# EAGLE design spot_check_rev_2 (EAGLE 9.6.2)
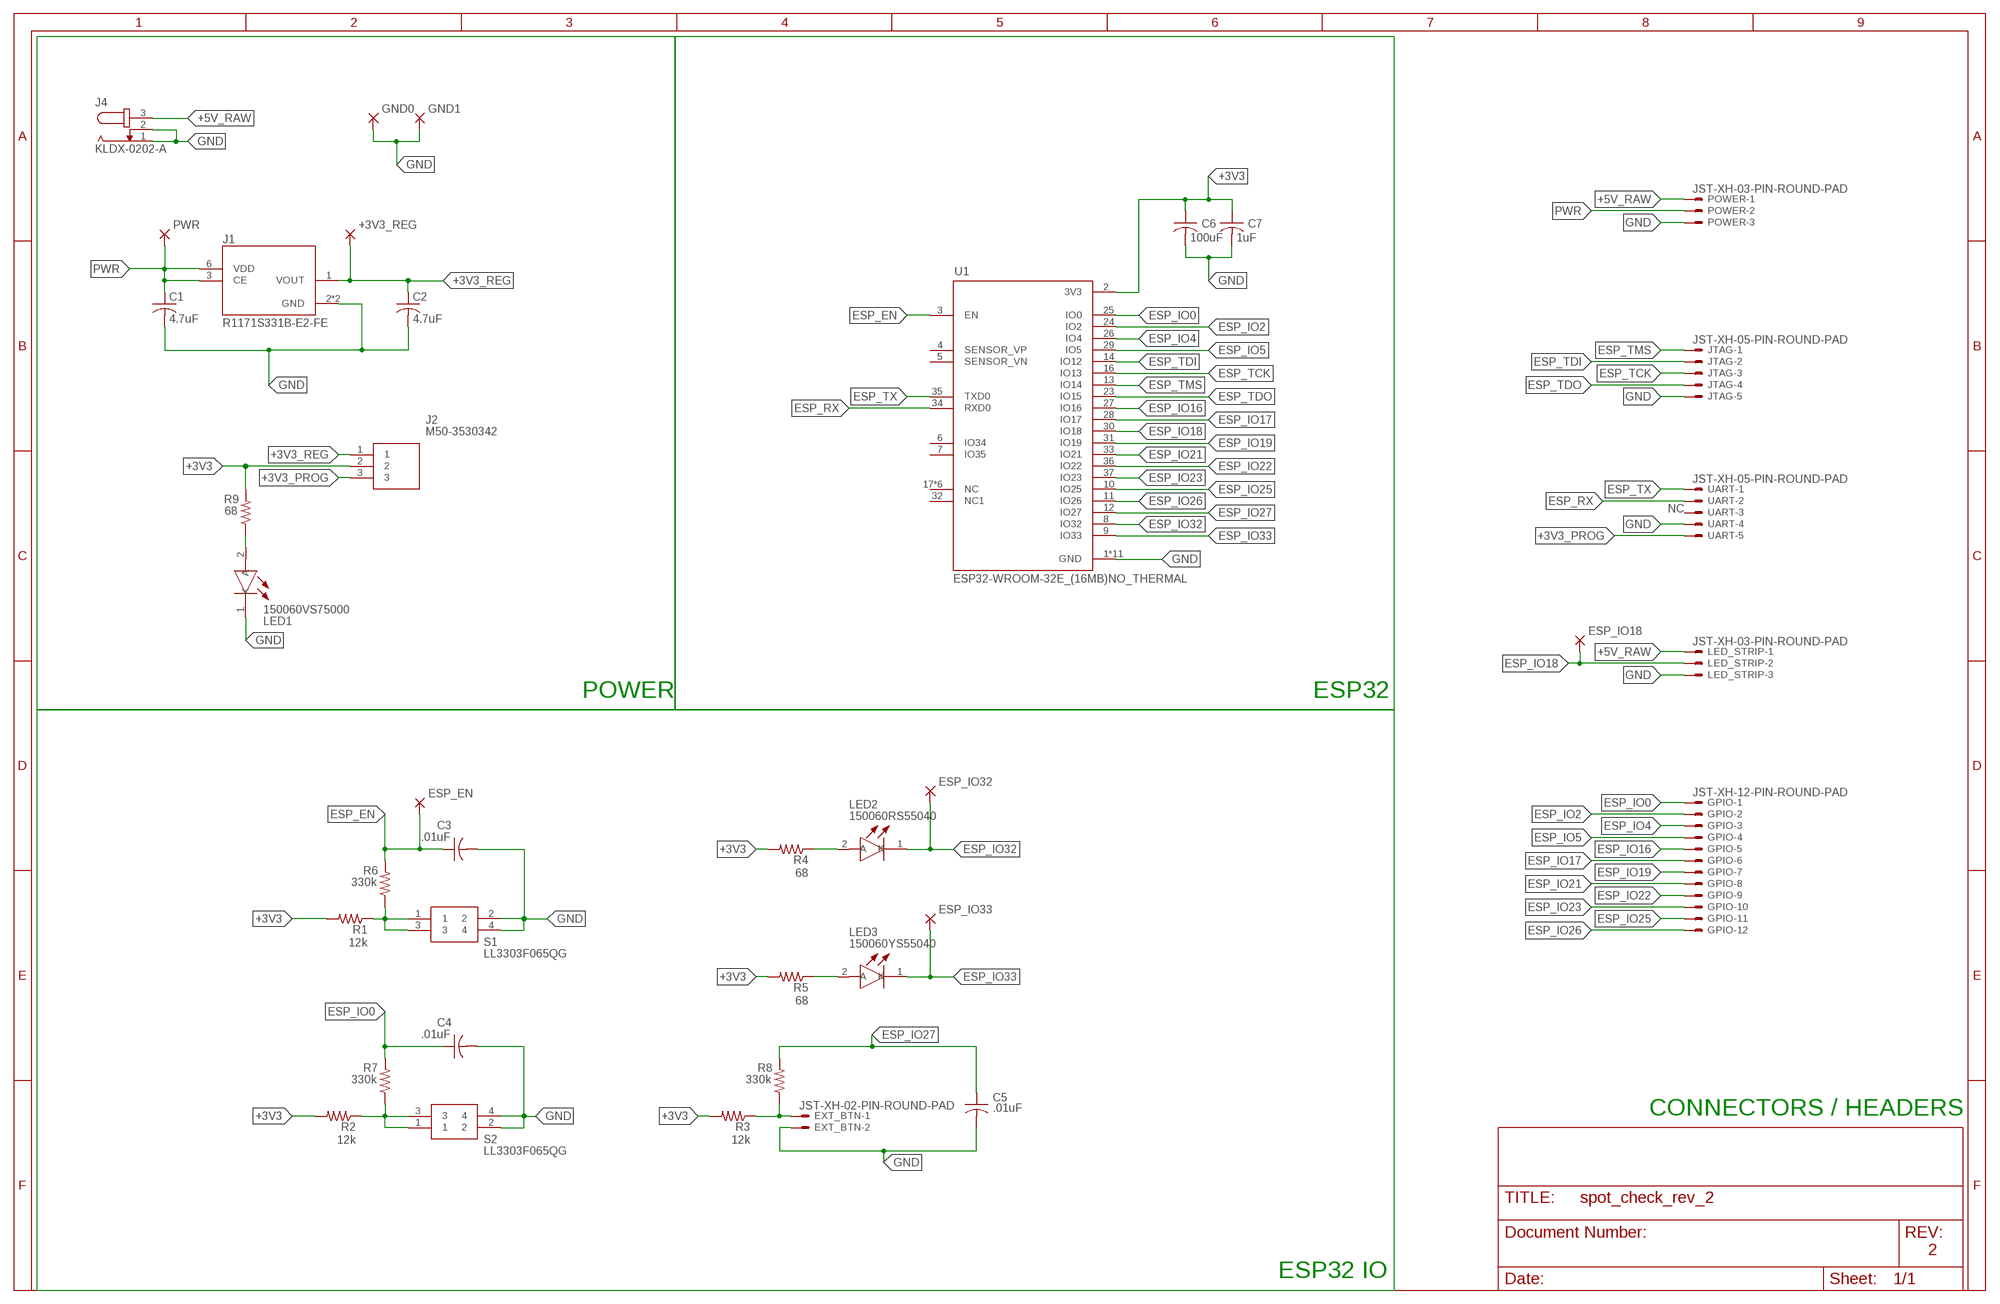
[diagram p0: schematic, sheet 1]

## Parts
+3V3_REG  TP  2,54/1,1  [2,54/1,1]
C1  4.7uF  C-USC0805  [C0805]
C2  4.7uF  C-USC0805  [C0805]
C3  .01uF  C-USC0805  [C0805]
C4  .01uF  C-USC0805  [C0805]
C5  .01uF  C-USC0805  [C0805]
C6  100uF  C-USC0805  [C0805]
C7  1uF  C-USC0805  [C0805]
ESP_EN  TP  2,54/1,1  [2,54/1,1]
ESP_IO18  TP  2,54/1,1  [2,54/1,1]
ESP_IO32  TP  2,54/1,1  [2,54/1,1]
ESP_IO33  TP  2,54/1,1  [2,54/1,1]
EXT_BTN  JST-XH-02-PIN-ROUND-PAD  [JST-XH-02-PACKAGE-ROUND-PAD]
GND0  TP  2,54/1,1  [2,54/1,1]
GND1  TP  2,54/1,1  [2,54/1,1]
GPIO  JST-XH-12-PIN-ROUND-PAD  [JST-XH-12-PACKAGE-ROUND-PAD]
J1  R1171S331B-E2-FE  R1171S421B-E2-FE  [REG_R1171S421B-E2-FE]
J2  M50-3530342  [HDRV3W40P0X127_1X3_381X210X430]
J4  KLDX-0202-A  CONN-JACK  [SPC4077]
JTAG  JST-XH-05-PIN-ROUND-PAD  [JST-XH-05-PACKAGE-ROUND-PAD]
LED1  150060VS75000  [LEDC1608X80N]
LED2  150060RS55040  150060VS75000  [LEDC1608X80N]
LED3  150060YS55040  150060VS75000  [LEDC1608X80N]
LED_STRIP  JST-XH-03-PIN-ROUND-PAD  [JST-XH-03-PACKAGE-ROUND-PAD]
POWER  JST-XH-03-PIN-ROUND-PAD  [JST-XH-03-PACKAGE-ROUND-PAD]
PWR  TP  2,54/1,1  [2,54/1,1]
R1  12k  R-US_R0805  [R0805]
R2  12k  R-US_R0805  [R0805]
R3  12k  R-US_R0805  [R0805]
R4  68  R-US_R0805  [R0805]
R5  68  R-US_R0805  [R0805]
R6  330k  R-US_R0805  [R0805]
R7  330k  R-US_R0805  [R0805]
R8  330k  R-US_R0805  [R0805]
R9  68  R-US_R0805  [R0805]
S1  LL3303F065QG  [LL3303F065QG]
S2  LL3303F065QG  [LL3303F065QG]
U1  ESP32-WROOM-32E_(16MB)NO_THERMAL  [MODULE_ESP32-WROOM-32E_(16MB)]
UART  JST-XH-05-PIN-ROUND-PAD  [JST-XH-05-PACKAGE-ROUND-PAD]

## Nets
+3V3: C6.1 C7.1 J2.2 R1.2 R2.2 R3.2 R4.2 R5.2 R9.2 U1.2(3V3)
+3V3_PROG: J2.3 UART.5
+3V3_REG: +3V3_REG.1(P) C2.1 J1.1(VOUT) J2.1
+5V_RAW: J4.3 LED_STRIP.1 POWER.1
ESP_EN: C3.1 ESP_EN.1(P) R6.2 U1.3(EN)
ESP_IO0: C4.1 GPIO.1 R7.2 U1.25(IO0)
ESP_IO2: GPIO.2 U1.24(IO2)
ESP_IO4: GPIO.3 U1.26(IO4)
ESP_IO5: GPIO.4 U1.29(IO5)
ESP_IO16: GPIO.5 U1.27(IO16)
ESP_IO17: GPIO.6 U1.28(IO17)
ESP_IO18: ESP_IO18.1(P) LED_STRIP.2 U1.30(IO18)
ESP_IO19: GPIO.7 U1.31(IO19)
ESP_IO21: GPIO.8 U1.33(IO21)
ESP_IO22: GPIO.9 U1.36(IO22)
ESP_IO23: GPIO.10 U1.37(IO23)
ESP_IO25: GPIO.11 U1.10(IO25)
ESP_IO26: GPIO.12 U1.11(IO26)
ESP_IO27: C5.1 R8.2 U1.12(IO27)
ESP_IO32: ESP_IO32.1(P) LED2.1(K) U1.8(IO32)
ESP_IO33: ESP_IO33.1(P) LED3.1(K) U1.9(IO33)
ESP_RX: U1.34(RXD0) UART.2
ESP_TCK: JTAG.3 U1.16(IO13)
ESP_TDI: JTAG.2 U1.14(IO12)
ESP_TDO: JTAG.4 U1.23(IO15)
ESP_TMS: JTAG.1 U1.13(IO14)
ESP_TX: U1.35(TXD0) UART.1
GND: C1.2 C2.2 C3.2 C4.2 C5.2 C6.2 C7.2 EXT_BTN.2 GND0.1(P) GND1.1(P) J1.2(GND) J1.5(GND) J4.1 J4.2 JTAG.5 LED1.1(K) LED_STRIP.3 POWER.3 S1.2 S1.4 S2.2 S2.4 U1.1(GND) U1.15(GND) U1.38(GND) U1.39_1(GND) U1.39_3(GND) U1.39_4(GND) U1.39_6(GND) U1.39_7(GND) U1.39_9(GND) U1.39_13(GND) U1.39_18(GND) UART.4
N$1: EXT_BTN.1 R3.1 R8.1
N$2: LED2.2(A) R4.1
N$3: LED3.2(A) R5.1
N$4: LED1.2(A) R9.1
N$5: R1.1 R6.1 S1.1 S1.3
N$6: R2.1 R7.1 S2.1 S2.3
PWR: C1.1 J1.3(CE) J1.6(VDD) POWER.2 PWR.1(P)
Unconnected: U1.4(SENSOR_VP) U1.5(SENSOR_VN) U1.6(IO34) U1.7(IO35) U1.17(NC) U1.18(NC) U1.19(NC) U1.20(NC) U1.21(NC) U1.22(NC) U1.32(NC1) UART.3

## Notes on the sheet
- POWER | ESP32
- CONNECTORS / HEADERS
- 2
- ESP32 IO

## Library data of the parts
+3V3_REG ESP_EN ESP_IO18 ESP_IO32 ESP_IO33 GND0 GND1 PWR = wirepad:2,54/1,1: THROUGH-HOLE PAD
C1-C7 = rcl:C-US: CAPACITOR, American symbol; SPICEPREFIX: C
EXT_BTN = Rembrandt Electronics - JST XH Connectors v1-0:JST-XH-02-PIN: JST XH Connector 2 Pin Wire to board connector. Pitch: 2,54 mm, (0.100") Number of pins: 2 Created by Rembrandt Electronics www.rembrandtelectronics.com
GPIO = Rembrandt Electronics - JST XH Connectors v1-0:JST-XH-12-PIN: JST XH Connector 2 Pin Wire to board connector. Pitch: 2,54 mm, (0.100") Number of pins: 12 Created by Rembrandt Electronics www.rembrandtelectronics.com
J1 = R1171S421B-E2-FE:R1171S421B-E2-FE: R1171x SERIES, 2.0A/1.5A LDO REUGULATOR Check prices <https://pricing.snapeda.com/parts/R1171S421B-E2-FE/Ricoh/view-part?ref=eda>; AVAILABILITY: In Stock; DESCRIPTION: Linear Voltage Regulator IC Positive Fixed 1 Output 1.5A 6-HSOP-J; MF: Ricoh; MP: R1171S421B-E2-FE; PACKAGE: SOIC-6 Ricoh; PRICE: None
J2 = M50-3530342:M50-3530342: Headers & Wire Housings 3 WAY SIL VERT PC TAIL P/HDR Source: Datasheet <https://cdn.harwin.com/pdfs/M50-353.pdf>; DESCRIPTION: Headers & Wire Housings 3 WAY SIL VERT PC TAIL P/HDR; HEIGHT: 4.3mm; MANUFACTURER_NAME: Harwin; MANUFACTURER_PART_NUMBER: M50-3530342; MOUSER_PART_NUMBER: 855-M50-3530342; MOUSER_PRICE-STOCK: https://www.mouser.co.uk/ProductDetail/Harwin/M50-3530342?qs=%252BdQmOuGyFcFOxjGK%2F4HnAg%3D%3D
J4 = custom-conn-jack:CONN-JACK
JTAG = Rembrandt Electronics - JST XH Connectors v1-0:JST-XH-05-PIN: JST XH Connector 2 Pin Wire to board connector. Pitch: 2,54 mm, (0.100") Number of pins: 5 Created by Rembrandt Electronics www.rembrandtelectronics.com
LED1-LED3 = 150060VS75000:150060VS75000: LED,Wurth Elektronik,150060VS75000 Wurth Elektronik 150060VS75000, WL-SMCW Series Green LED, 570 nm, 1608 (0603) Clear, Rectangle Lens SMD Package Source: Datasheet <http://docs-emea.rs-online.com/webdocs/1302/0900766b81302e1e.pdf> Check prices <https://pricing.snapeda.com/parts/150060VS75000/Wurth%20Elektronik/view-part?ref=eda>; AVAILABILITY: In Stock; DESCRIPTION: Green 570nm LED Indication - Discrete 2V 0603 (1608 Metric); MF: Wurth Elektronik; MP: 150060VS75000; PACKAGE: None; PRICE: None
LED_STRIP POWER = Rembrandt Electronics - JST XH Connectors v1-0:JST-XH-03-PIN: JST XH Connector 2 Pin Wire to board connector. Pitch: 2,54 mm, (0.100") Number of pins: 3 Created by Rembrandt Electronics www.rembrandtelectronics.com
R1-R9 = rcl:R-US_: RESISTOR, American symbol; SPICEPREFIX: R
S1 S2 = LL3303F065QG:LL3303F065QG: Pushbutton Switches 50mA 12VDC F065 7.0mm Gull Wing Source: Datasheet <http://spec_sheets.e-switch.com/specs/P090008.pdf>; DESCRIPTION: Pushbutton Switches 50mA 12VDC F065 7.0mm Gull Wing; HEIGHT: 3.4mm; MANUFACTURER_NAME: E-Switch; MANUFACTURER_PART_NUMBER: LL3303F065QG; MOUSER_PART_NUMBER: 612-LL3303F065QG; MOUSER_PRICE-STOCK: https://www.mouser.co.uk/ProductDetail/E-Switch/LL3303F065QG?qs=QtyuwXswaQjocAyEnLyPSg%3D%3D
U1 = ESP32-WROOM-32E__16MB_:ESP32-WROOM-32E_(16MB): Bluetooth, WiFi 802.11b/g/n, Bluetooth v4.2 +EDR, Class 1, 2 and 3 Transceiver Module 2.4GHz ~ 2.5GHz Integrated, Trace Surface Mount Check prices <https://pricing.snapeda.com/parts/ESP32-WROOM-32E%20%2816MB%29/Espressif%20Systems/view-part?ref=eda>
UART = Rembrandt Electronics - JST XH Connectors v1-0:JST-XH-05-PIN: JST XH Connector 2 Pin Wire to board connector. Pitch: 2,54 mm, (0.100") Number of pins: 5 Created by Rembrandt Electronics www.rembrandtelectronics.com; NC: NC

## Board
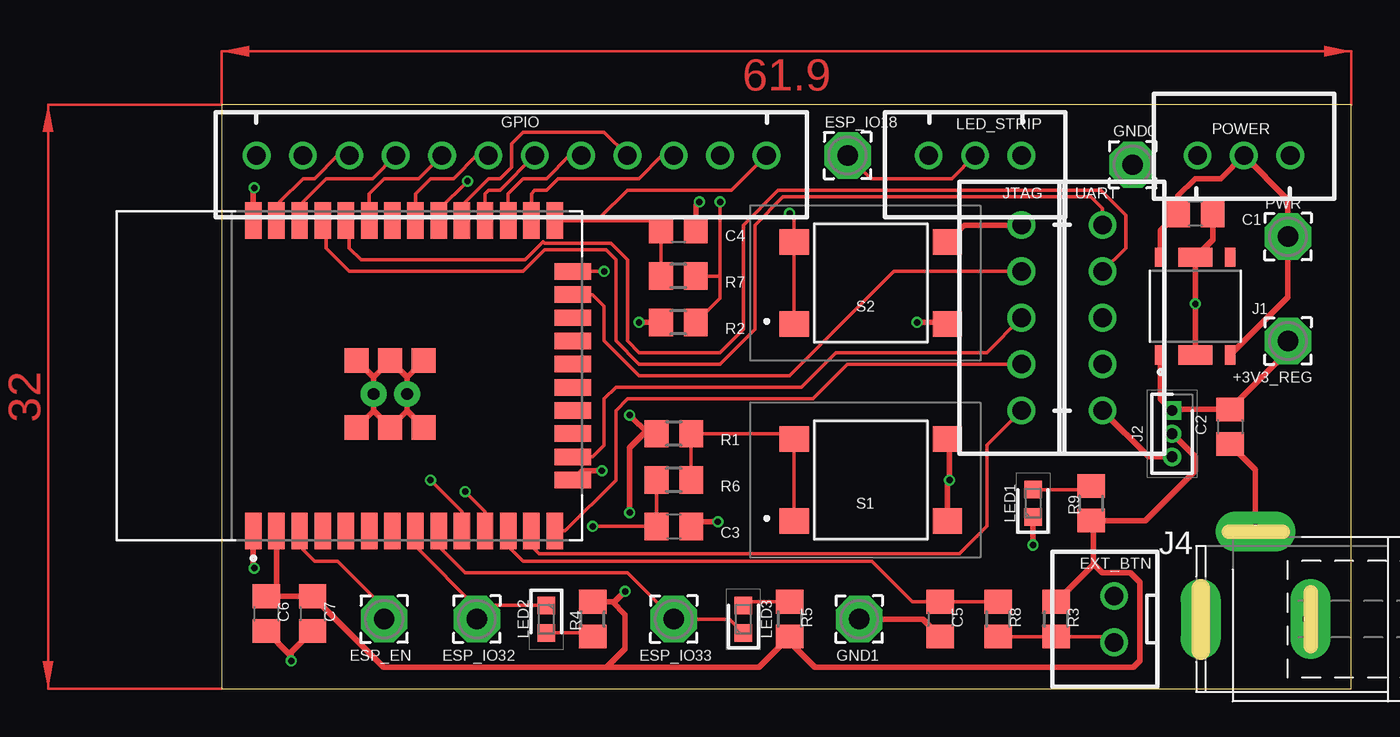
[diagram p1: board, top side]
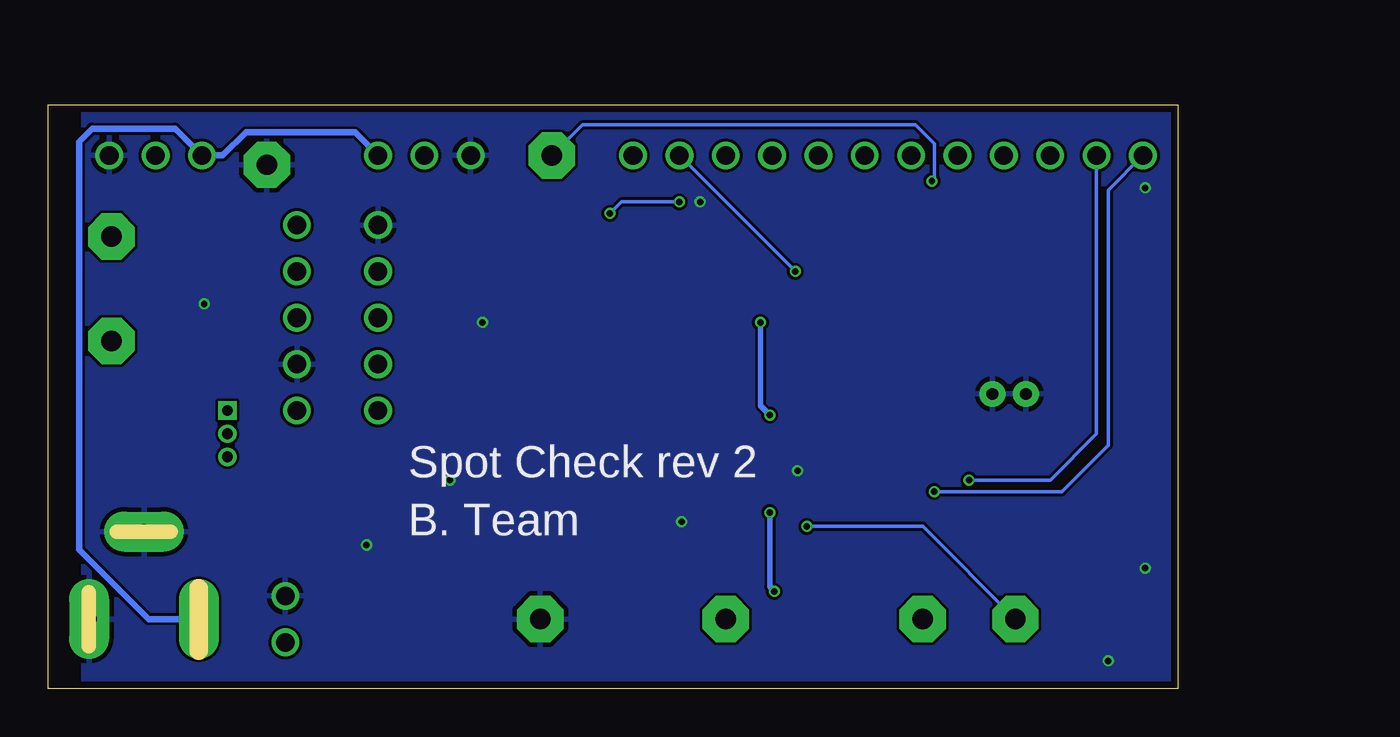
[diagram p2: board, bottom side, seen from below]

Size 61.9 x 32 mm. Coordinates in mm from the lower left corner, seen from the top.
Outline: 0,0 61.9,0 61.9,32 0,32 0,0
Copper layers (1*16): Top 0.035559375mm / dielectric 1.6mm / Bottom 0.035559375mm
Design rules "oshpark-2layer": minimum track width 6mil, minimum drill 10mil, track to track 6mil, track to pad 6mil, pad to pad 6mil, via to via 6mil, smd to smd 6mil, copper to edge 15mil, drill to drill 6mil, minimum pad ring 5mil, minimum via ring 5mil, stop-mask expansion 2.5mil, vias tented up to drill 0mil, thermal gap 10mil

### Footprints (pad centres in the part's own frame; a part is rotated, then mirrored left to right if it is on the bottom)
2,54/1,1 = drill 1.118 pad 2.54 octagon: 1 0,0
C0805 = smd 1.3 x 1.5: 1 -0.95,0; 2 0.95,0
JST-XH-02-PACKAGE-ROUND-PAD = drill 1.016: 1 -1.27,0; 2 1.27,0
JST-XH-12-PACKAGE-ROUND-PAD = drill 1.016: 1 -13.97,0; 2 -11.43,0; 3 -8.89,0; 4 -6.35,0; 5 -3.81,0; 6 -1.27,0; 7 1.27,0; 8 3.81,0; 9 6.35,0; 10 8.89,0; 11 11.43,0; 12 13.97,0
REG_R1171S421B-E2-FE = smd 1.05 x 0.6: 1 -2.675,1.905; 3 -2.675,-1.905; 4 2.675,-1.905; 6 2.675,1.905 | smd 1.05 x 1.87: 2 -2.675,0; 5 2.675,0
HDRV3W40P0X127_1X3_381X210X430 = drill 0.6 pad 1 square: 1 0,0 | drill 0.6 pad 1: 2 1.27,0; 3 2.54,0
SPC4077 = drill 0.8 pad 2.184 long: 1 -3,0; 2 0,-4.8 | drill 1 pad 2.184 long: 3 3,0
JST-XH-05-PACKAGE-ROUND-PAD = drill 1.016: 1 -5.08,0; 2 -2.54,0; 3 0,0; 4 2.54,0; 5 5.08,0
LEDC1608X80N = smd 0.95 x 0.95: 1 -0.75,0; 2 0.75,0
JST-XH-03-PACKAGE-ROUND-PAD = drill 1.016: 1 -2.54,0; 2 0,0; 3 2.54,0
R0805 = smd 1.3 x 1.5: 1 -0.95,0; 2 0.95,0
LL3303F065QG = smd 1.6 x 1.4: 1 -4.2,-2.25; 2 4.2,-2.25; 3 -4.2,2.25; 4 4.2,2.25
MODULE_ESP32-WROOM-32E_(16MB) = smd 2 x 0.9: 1 -8.5,5.26; 2 -8.5,3.99; 3 -8.5,2.72; 4 -8.5,1.45; 5 -8.5,0.18; 6 -8.5,-1.09; 7 -8.5,-2.36; 8 -8.5,-3.63; 9 -8.5,-4.9; 10 -8.5,-6.17; 11 -8.5,-7.44; 12 -8.5,-8.71; 13 -8.5,-9.98; 14 -8.5,-11.25; 25 8.5,-11.25; 26 8.5,-9.98; 27 8.5,-8.71; 28 8.5,-7.44; 29 8.5,-6.17; 30 8.5,-4.9; 31 8.5,-3.63; 32 8.5,-2.36; 33 8.5,-1.09; 34 8.5,0.18; 35 8.5,1.45; 36 8.5,2.72; 37 8.5,3.99; 38 8.5,5.26 | smd 0.9 x 2: 15 -5.715,-12.25; 16 -4.445,-12.25; 17 -3.175,-12.25; 18 -1.905,-12.25; 19 -0.635,-12.25; 20 0.635,-12.25; 21 1.905,-12.25; 22 3.175,-12.25; 23 4.445,-12.25; 24 5.715,-12.25 | smd 1.33 x 1.33: 39_1 -2.835,-0.405; 39_3 0.835,-0.405; 39_4 -2.835,-2.24; 39_6 0.835,-2.24; 39_7 -2.835,-4.075; 39_9 0.835,-4.075 | drill 0.65 pad 1.422: 39_13 -1,-1.323; 39_18 -1,-3.158

### Placement (x,y rotation side)
+3V3_REG  58.42,19.05 0 top
C1  53.34,26.04 0 top
C2  55.24,14.35 270 top
C3  24.77,8.89 0 top
C4  25.02,25.15 0 top
C5  39.37,3.81 270 top
C6  2.44,4.11 270 top
C7  4.98,4.11 270 top
ESP_EN  8.89,3.81 0 top
ESP_IO18  34.29,29.21 0 top
ESP_IO32  13.97,3.81 0 top
ESP_IO33  24.77,3.81 0 top
EXT_BTN  48.9,3.81 90 top
GND0  49.91,28.7 0 top
GND1  34.92,3.81 0 top
GPIO  15.88,29.21 180 top
J1  53.34,20.95 90 top
J2  52.07,15.24 270 top
J4  56.64,3.81 180 top
JTAG  43.81,20.32 90 top
LED1  44.45,10.16 90 top
LED2  17.78,3.81 270 top
LED3  28.57,3.81 90 top
LED_STRIP  41.27,29.21 180 top
POWER  56.01,29.21 0 top
PWR  58.42,24.77 0 top
R1  24.77,13.97 180 top
R2  25.02,20.07 180 top
R3  45.72,3.81 90 top
R4  20.32,3.81 90 top
R5  31.11,3.81 270 top
R6  24.77,11.43 180 top
R7  25.02,22.61 180 top
R8  42.55,3.81 90 top
R9  47.62,10.16 270 top
S1  35.56,11.43 0 top
S2  35.56,22.23 0 top
U1  6.99,17.14 90 top
UART  48.26,20.32 270 top

### Tracks (layer width: path | path; a pad name or v marks a point on that pad's centre or on a via)
+3V3  (via drill 0.35)
  Top 0.305: J2.2 53.34,12.7 53.34,11.94 50.61,9.21 R9.2 47.75,9.08 47.75,6.86 | U1.2 3,5.62 C6.1 C7.1 8.88,1.17 21.08,1.17 | 21.08,1.17 22.1,2.18 22.1,4.06 21.4,4.76 | 21.4,4.76 R4.2 | 21.08,1.17 29.42,1.17 R5.2 31.11,2.56 32.51,1.17 49.94,1.17 50.29,1.52 50.29,5.84 49.78,6.35 48.26,6.35 47.75,6.86 | 47.75,6.86 47.75,6.79 R3.2 | R2.2 v22.86,20.07 | v22.35,14.99 23.37,13.97 R1.2 23.11,13.97 22.35,13.21 v22.35,9.65 | v22.1,5.33 21.52,4.76 21.4,4.76
  Bottom 0.305: v22.86,20.07 22.86,15.49 v22.35,14.99 | v22.35,9.65 22.35,5.59 v22.1,5.33
+3V3_PROG
  Top 0.305: J2.3 50.8,12.7 UART.5
+3V3_REG
  Top 0.305: J1.1 51.44,15.88 J2.1 52.13,15.3 C2.1 58.42,18.48 +3V3_REG.1
+5V_RAW
  Bottom 0.356: LED_STRIP.1 45.09,30.48 51.05,30.48 52.32,29.21 POWER.1 54.94,30.68 59.49,30.68 60.2,29.97 60.2,7.62 56.39,3.81 J4.3
ESP_EN  (via drill 0.35)
  Top 0.203: R6.2 C3.1 v20.32,8.89 | U1.3 4.45,8.46 4.45,7.62 5.08,6.99 6.35,6.99 8.89,4.45 ESP_EN.1
  Bottom 0.203: v20.32,8.89 13.97,8.89 ESP_EN.1
ESP_IO0
  Top 0.203: 20.71,25.64 U1.25 | R7.2 C4.1 23.57,25.64 20.71,25.64 | GPIO.1 27.94,27.3 22.23,27.3 20.71,25.79 20.71,25.64
ESP_IO2  (via drill 0.35)
  Top 0.203: U1.24 v20.95,22.86
  Bottom 0.203: v20.95,22.86 GPIO.2
ESP_IO4
  Top 0.203: GPIO.3 24.13,29.21 22.86,27.94 18.41,27.94 17.78,27.3 17.14,27.3 16.96,27.12 U1.26
ESP_IO5
  Top 0.203: GPIO.4 20.95,30.48 16.51,30.48 15.88,29.84 15.88,28.57 15.24,27.94 14.61,27.94 13.15,26.49 U1.29
ESP_IO16
  Top 0.203: U1.27 15.7,27.12 16.51,27.94 17.78,27.94 19.05,29.21 GPIO.5
ESP_IO17
  Top 0.203: U1.28 14.43,27.12 14.61,27.3 15.24,27.3 GPIO.6
ESP_IO18  (via drill 0.35)
  Top 0.203: v13.46,27.81 11.88,26.23 U1.30 | ESP_IO18.1 35.56,27.94 40.01,27.94 LED_STRIP.2
  Bottom 0.203: ESP_IO18.1 32.62,30.88 14.37,30.88 13.34,29.84 13.34,27.94 v13.46,27.81
ESP_IO19
  Top 0.203: GPIO.7 13.97,29.21 12.7,27.94 11.43,27.94 10.62,27.12 U1.31
ESP_IO21
  Top 0.203: U1.33 8.07,27.12 8.89,27.94 10.79,27.94 GPIO.8
ESP_IO22
  Top 0.203: U1.36 4.45,25.82 4.45,26.67 5.71,27.94 8.26,27.94 GPIO.9
ESP_IO23
  Top 0.203: U1.37 3.17,25.82 3.17,26.67 4.45,27.94 5.08,27.94 6.35,29.21 GPIO.10
ESP_IO25  (via drill 0.35)
  Top 0.203: v11.43,11.43 13.15,9.71 U1.10
  Bottom 0.203: GPIO.11 4.45,13.97 6.99,11.43 v11.43,11.43
ESP_IO26  (via drill 0.35)
  Top 0.203: v13.34,10.79 14.43,9.71 U1.11
  Bottom 0.203: GPIO.12 3.81,27.3 3.81,13.34 6.35,10.79 v13.34,10.79
ESP_IO27
  Top 0.203: U1.12 15.7,7.8 16.51,6.99 35.62,6.99 37.84,4.76 C5.1 R8.2
ESP_IO32
  Top 0.203: LED2.1 14.72,4.56 ESP_IO32.1 13.97,4.45 10.62,7.8 U1.8
ESP_IO33
  Top 0.203: U1.9 11.88,7.8 13.34,6.35 22.23,6.35 ESP_IO33.1 27.82,3.81 LED3.1
ESP_RX
  Top 0.203: U1.34 6.99,25.46 6.99,24.13 7.62,23.5 16.62,23.5 17.6,24.47 17.68,24.39 21.33,24.39 22.23,23.5 22.23,19.05 22.86,18.41 27.3,18.41 28.57,19.68 28.57,25.4 30.48,27.3 48.17,27.3 49.53,25.95 49.53,24.13 UART.2
ESP_TCK
  Top 0.203: JTAG.3 41.91,18.41 33.66,18.41 31.75,16.51 21.59,16.51 20.95,15.88 20.95,13.34 20.32,12.7 U1.16
ESP_TDI
  Top 0.203: JTAG.2 34.29,17.78 32.38,15.88 22.23,15.88 21.59,15.24 21.59,11.43 18.8,8.64 U1.14
ESP_TDO
  Top 0.203: JTAG.4 36.83,22.86 31.11,17.14 22.86,17.14 20.95,19.05 20.95,20.95 20.32,21.59 U1.23
ESP_TMS
  Top 0.203: JTAG.1 41.91,13.34 41.91,8.89 40.41,7.39 17.37,7.39 16.96,7.8 U1.13
ESP_TX
  Top 0.203: U1.35 5.71,25.46 5.71,24.13 6.99,22.86 16.51,22.86 17.68,24.04 21.05,24.04 21.59,23.5 21.59,19.05 22.86,17.78 27.3,17.78 29.21,19.68 29.21,25.4 30.76,26.95 47.62,26.95 48.26,26.31 UART.1
GND  (via drill 0.35)
  Top 0.305: C4.2 25.97,26.48 v26.16,26.67 | S2.4 40.69,25.4 JTAG.5 | C1.2 54.29,24.58 J1.5 v53.34,21.08 J1.2 | GND1.1 38.42,3.81 C5.2 | C7.2 3.81,2 v3.81,1.52 3.81,1.79 C6.2 | v1.78,6.6 1.73,6.66 U1.1 | U1.38 1.73,27.38 v1.78,27.43 | C3.2 25.97,9.14 v27.18,9.14 | U1.15 19.74,11.94 v20.83,11.94 | S1.4 39.88,13.56 v39.88,11.43 39.76,11.31 S1.2 | v44.45,7.87 LED1.1 | v38.1,20.07 39.67,20.07 S2.2 | U1.39_3 8.31,17.06 | 8.31,17.06 U1.39_13 8.31,15.23 | 8.31,17.06 U1.39_6 10.14,17.06 | 10.14,17.06 U1.39_18 10.14,15.23 | U1.39_9 10.14,17.06 | U1.39_7 10.14,15.23 | 10.14,15.23 U1.39_4 8.31,15.23 | U1.39_1 8.31,15.23 | C2.2 56.64,12 J4.2
  pour Bottom: 0,0 0,32 59.94,32 59.94,0
N$1
  Top 0.203: R8.1 R3.1 48.58,2.86 EXT_BTN.1
N$2
  Top 0.203: R4.1 20.12,3.06 LED2.2
N$3
  Top 0.203: LED3.2 28.77,4.76 R5.1
N$4
  Top 0.203: R9.1 47.42,10.91 LED1.2
N$5
  Top 0.203: S1.1 S1.3 31.07,13.97 R1.1 R6.1
N$6  (via drill 0.35)
  Top 0.203: S2.1 S2.3 31.36,25.79 v31.11,26.04 | v27.3,26.67 27.3,22.61 | 27.3,22.61 27.3,21.4 R2.1 | R7.1 27.3,22.61
  Bottom 0.203: v31.11,26.04 30.48,26.67 v27.3,26.67
PWR
  Top 0.305: J1.6 51.44,25.08 C1.1 52.39,26.99 53.34,27.94 54.74,27.94 POWER.2 58.42,26.8 PWR.1 58.42,21.45 J1.3
(copper drawn outside any net)
  shapes: Top area x2

### Text on the board
bNames: Spot Check rev 2 | B. Team